# Altium schematic sheet 2. MCU & Peripherals.SchDoc: 2. Arduino Nano & ESP-WROOM-32
size A4; CompanyName: Keri Studio; DrawnBy: Ashis Talaviya; Organization: KERI STUDIO; Address1: ICG COMPOUND; Address2: NR. BHAVANI CIRCLE; Address3: A.K. ROAD; Address4: SURAT-395008; DocumentNumber: 2; Revision: 1.0; SheetNumber: 2; SheetTotal: 4
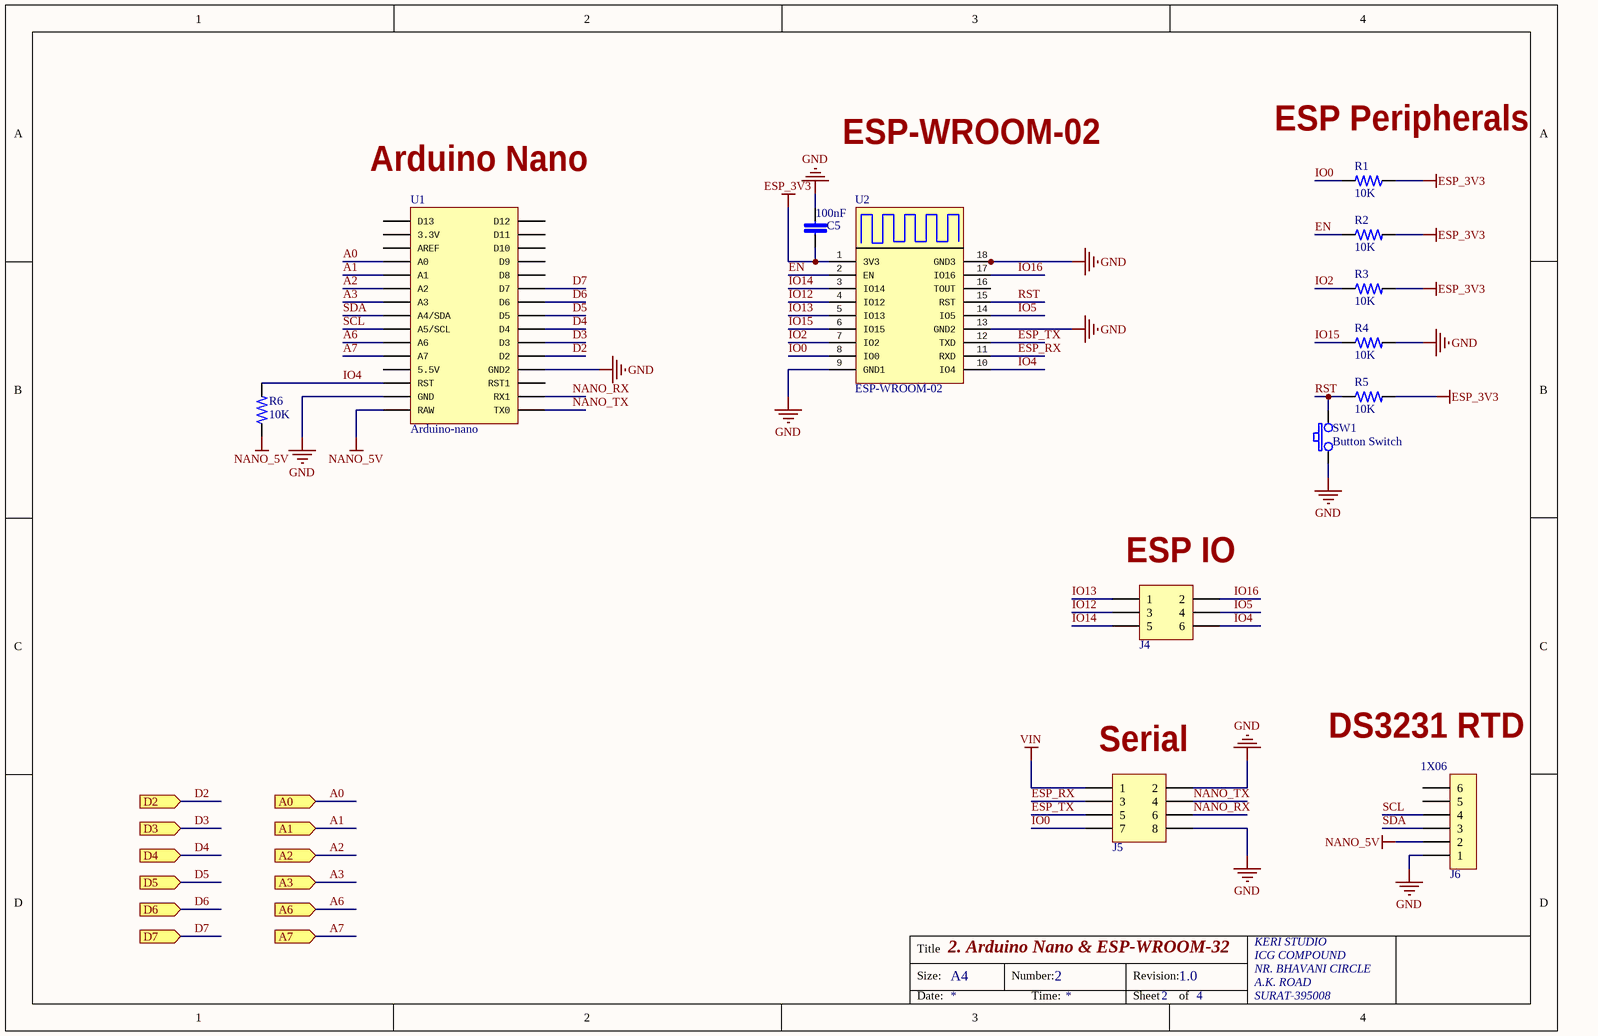
[diagram p0: 2. MCU & Peripherals.SchDoc]

## Parts
C5  100nF  [C0805]
J4  2X03  [Header_2.54mm_2X03]  (value not drawn)
J5  2X04  [Header_2.54mm_2X04]  (value not drawn)
J6  1X06  [Header_2.54mm_1X06]
R1  10K  [R0805]
R2  10K  [R0805]
R3  10K  [R0805]
R4  10K  [R0805]
R5  10K  [R0805]
R6  10K  [R0805]
SW1  Button Switch  [KSR231GLFS]
U1  Arduino-nano  [ARDUINO_NANO]
U2  ESP-WROOM-02  [ESP-WROOM-02]

## Ports
A0 (in), A1 (in), A2 (in), A3 (in), A6 (in), A7 (in), D2 (in), D3 (in), D4 (in), D5 (in), D6 (in), D7 (in)

## Nets
ESP_3V3: C5.2 R1.1 R2.2 R3.2 R5.2 U2.1(3V3)
GND: C5.1 J5.2 J5.8 J6.1 R4.2 SW1.1 U1.GND U1.GND1(GND2) U2.9(GND1) U2.13(GND2) U2.18(GND3) U2.19(GND0)
NANO_5V: J6.2 R6.1 U1.RAW
VIN: J5.1
A0: U1.A0 ; port A0
A1: U1.A1 ; port A1
A2: U1.A2 ; port A2
A3: U1.A3 ; port A3
A6: U1.A6 ; port A6
A7: U1.A7 ; port A7
D2: U1.D2 ; port D2
D3: U1.D3 ; port D3
D4: U1.D4 ; port D4
D5: U1.D5 ; port D5
D6: U1.D6 ; port D6
D7: U1.D7 ; port D7
EN: R2.1 U2.2(EN)
ESP_RX: J5.3 U2.11(RXD)
ESP_TX: J5.5 U2.12(TXD)
IO0: J5.7 R1.2 U2.8(IO0)
IO2: R3.1 U2.7(IO2)
IO4: J4.6 R6.2 U1.RST U2.10(IO4)
IO5: J4.4 U2.14(IO5)
IO12: J4.3 U2.4(IO12)
IO13: J4.1 U2.5(IO13)
IO14: J4.5 U2.3(IO14)
IO15: R4.1 U2.6(IO15)
IO16: J4.2 U2.17(IO16)
NANO_RX: J5.6 U1.RX1
NANO_TX: J5.4 U1.TX0
RST: R5.1 SW1.2 U2.15(RST)
SCL: J6.4 U1.A5(A5/SCL)
SDA: J6.3 U1.A4(A4/SDA)

Not connected (* = marked no-connect by the designer): J6 5 6; U1 3.3V 5V(5.5V) AREF D8 D9 D10 D11 D12 D13 RST1; U2 16(TOUT)

## Notes on the sheet
- (near U1) Arduino Nano
- ESP-WROOM-02
- (near R1) ESP Peripherals
- (near J4) ESP IO
- (near J5) Serial
- (near J6) DS3231 RTD
- Title
- Size:
- A4
- Number:
- Revision:
- Date:
- Time:
- Sheet
- of

## Library data of the parts
C5 = C_0805_0.1uF: Multilayer Ceramic Capacitors MLCC - SMD/SMT 0805 0.1uF 50volts X7R 20%; Manufacturer: Murata; Manufacturer Part Number: GCJ21BR71H104MA01L; Supplier 1: Mouser; Supplier Part Number 1: 81-GCJ21BR71H104MA1L; Stock 1: 0
J4 = Header_2.54mm_2X03: Headers & Wire Housings 03+03 DIL VERTICAL PIN HEADER TIN; Manufacturer: Harwin; Manufacturer Part Number: M20-9980346; Number of Contacts: 6; Contact Resistance: 25mR; Current Rating: 3A; Gender: Male; Insulation Resistance: 10GR; Connector Type: Male Pin; Pitch: 2.54mm; Row Spacing: 0.1inch; Supplier 1: Mouser; Stock 1: 8602; Pricing 1: 1=0.24, 10=0.229, 50=0.229, 100=0.159, 1000=0.11, 10000=0.089 (USD); Mount: Through Hole; Contact Plating: Nickel,Tin; Colour: Black; Contact Material: Bronze,Brass; Housing Colour: Black; Housing Material: Nylon; Min Operating Temperature: -40°C; Max Operating Temperature: 105°C; Number of Rows: 2; Termination: Solder; Package Quantity: 1000; Packaging: Bag; Max Current Rating: 3A; Number of Positions: 6; Orientation: Straight; Length: 7.62mm; Contact Mating Length: 0.24inch; Depth: 5.08mm; Radiation Hardening: No; REACH SVHC: No SVHC; ComponentLink1URL: https://datasheet.ciiva.com/11745/0900766b81034e61-11745752.pdf; ComponentLink1Description: https://datasheet.ciiva.com/11745/0900766b81034e61-11745752.pdf; ComponentLink2URL: https://datasheet.ciiva.com/26899/getdatasheetpartid-483857-26899433.pdf; ComponentLink2Description: https://datasheet.ciiva.com/26899/getdatasheetpartid-483857-26899433.pdf; ComponentLink3URL: https://datasheet.ciiva.com/8046/112195-8046906.pdf; ComponentLink3Description: https://datasheet.ciiva.com/8046/112195-8046906.pdf; Supplier Part Number 1: 855-M20-9980346
J5 = Header_2.54mm_2X04: Headers & Wire Housings 04+04 DIL VERTICAL PIN HEADER TIN; Manufacturer: Harwin; Manufacturer Part Number: M20-9980446; Number of Contacts: 8; Max Current Rating: 3A; Contact Resistance: 30mR; Gender: Male; Insulation Resistance: 10GR; Connector Type: Male Pin; Pitch: 2.54mm; Row Spacing: 0.1inch; Supplier 1: Mouser; Stock 1: 10983; Pricing 1: 1=0.3, 10=0.28, 50=0.28, 100=0.196, 1000=0.14, 10000=0.112 (USD); Mount: Through Hole; Contact Plating: Tin; Contact Material: Bronze,Brass; Colour: Black; Housing Colour: Black; Housing Material: Nylon; Min Operating Temperature: -40°C; Max Operating Temperature: 105°C; Number of Rows: 2; Termination: Solder; Current Rating: 3A; Package Quantity: 1000; Packaging: Bag; Number of Positions: 8; Orientation: Straight; Length: 10.16mm; Contact Mating Length: 0.24inch; Depth: 5.08mm; Radiation Hardening: No; REACH SVHC: No SVHC; ComponentLink1URL: https://datasheet.ciiva.com/11745/0900766b81034e61-11745748.pdf; ComponentLink1Description: https://datasheet.ciiva.com/11745/0900766b81034e61-11745748.pdf; ComponentLink2URL: https://datasheet.ciiva.com/6814/m20-998-6814757.pdf; ComponentLink2Description: https://datasheet.ciiva.com/6814/m20-998-6814757.pdf; ComponentLink3URL: https://datasheet.ciiva.com/9480/m20-998-9480200.pdf; ComponentLink3Description: https://datasheet.ciiva.com/9480/m20-998-9480200.pdf; ComponentLink4URL: https://datasheet.ciiva.com/26899/getdatasheetpartid-505183-26899434.pdf; ComponentLink4Description: https://datasheet.ciiva.com/26899/getdatasheetpartid-505183-26899434.pdf; ComponentLink5URL: https://datasheet.ciiva.com/8046/112195-8046909.pdf; ComponentLink5Description: https://datasheet.ciiva.com/8046/112195-8046909.pdf; Supplier Part Number 1: 855-M20-9980446
J6 = Header_2.54mm_1X06: CONNECTOR, 6WAY, VERTICAL, 2.54; Manufacturer: TE Connectivity; Manufacturer Part Number: 826646-6; Number of Contacts: 6; Connector Type: Plug,Pin,Header; PCB Mount Retention: Without; Board Standoff: No (Without); Keyed: No; Current Rating: 3A; Plating Thickness: 0.8um; Pitch: 2.54mm; Mating Post Length: 5.8mm; Supplier 1: Mouser; Stock 1: 1670; Pricing 1: 1=0.79, 10=0.693, 50=0.693, 100=0.598, 1000=0.435, 10000=0.354 (USD); Mount: Straddle Mount; Contact Plating: Tin,Gold; Contact Material: Bronze; Colour: Green; Housing Colour: Green; Housing Material: PBT; Contact Shape: Square; Min Operating Temperature: -65°C; Max Operating Temperature: 105°C; Number of Rows: 1; Termination: Through Hole; Packaging: Carton; Package Quantity: 1000; Number of Positions: 6; Orientation: Straight; PCB Mounting Orientation: Vertical; Contact Gender: Male; Contact Protection: No (Without); Gasket: No (Without); Mating Alignment: No (Without); Mating Connector Lock: No (Without); Selectively Loaded: No (Without); Stabilizers: No (Without); Strain Relief: No (Without); High Speed Serial Data Connector: No; High Temperature Housing: No; Length: 15.24mm; Termination Post Length: 0.1259inch; Contact Mating Length: 0.228inch; Row Spacing: 2.54mm; Depth: 2.5mm; Radiation Hardening: No; Flammability Rating: UL94 V-0; REACH SVHC: No SVHC; ComponentLink1URL: https://datasheet.ciiva.com/1448/47535-1448067.pdf; ComponentLink1Description: https://datasheet.ciiva.com/1448/47535-1448067.pdf; ComponentLink2URL: https://datasheet.ciiva.com/49517/abc918-49517591.pdf; ComponentLink2Description: https://datasheet.ciiva.com/49517/abc918-49517591.pdf; ComponentLink3URL: https://datasheet.ciiva.com/6816/eng-cd-826629-aa-basefilename-6816056.pdf; ComponentLink3Description: https://datasheet.ciiva.com/6816/eng-cd-826629-aa-basefilename-6816056.pdf; ComponentLink4URL: https://datasheet.ciiva.com/11754/0900766b80d7c469-11754285.pdf; ComponentLink4Description: https://datasheet.ciiva.com/11754/0900766b80d7c469-11754285.pdf; ComponentLink5URL: https://datasheet.ciiva.com/29369/001094744-da-01-en-stiftleiste-1-reihig-0-0826646-6-29369560.pdf; ComponentLink5Description: https://datasheet.ciiva.com/29369/001094744-da-01-en-stiftleiste-1-reihig-0-0826646-6-29369560.pdf; Supplier Part Number 1: 571-826646-6
R1-R6 = R_0805_10K: Thick Film Resistors - SMD 10K 0805 5%; Manufacturer: Bourns; Manufacturer Part Number: CR0805-JW-103ELF; Resistance: 10kR; Temperature Coefficient: 200ppm/°C; Power Rating: 125mW; Voltage Rating: 150V; Voltage Rating (DC): 100V; Supplier 1: Mouser; Supplier Part Number 1: 652-CR0805-JW-103ELF; Stock 1: 36802; Pricing 1: 1=0.1, 10=0.03, 50=0.03, 100=0.017, 1000=0.008, 10000=0.006 (USD); Mount: Surface Mount; Case/Package: 0805; Number of Pins: 2; Contact Plating: Tin; Case Code (Metric): 2012; Case Code (Imperial): 0805; Min Operating Temperature: -55°C; Max Operating Temperature: 155°C; Tolerance: 5%; Composition: Thick Film; Package Quantity: 1; Packaging: Tape and Reel; Number of Terminations: 2; Termination: SMD/SMT; Military Standard: Not; Max Power Dissipation: 125mW; Length: 2mm; Height: 0.5mm; Width: 1.25mm; Depth: 1.25mm; Thickness: 508um; Radiation Hardening: No; REACH SVHC: No SVHC; ComponentLink1URL: https://datasheet.ciiva.com/11821/0900766b80fcdb72-11821135.pdf; ComponentLink1Description: https://datasheet.ciiva.com/11821/0900766b80fcdb72-11821135.pdf; ComponentLink2URL: https://datasheet.ciiva.com/9122/chpreztr-9122374.pdf; ComponentLink2Description: https://datasheet.ciiva.com/9122/chpreztr-9122374.pdf; ComponentLink3URL: https://datasheet.ciiva.com/22693/1902866-22693254.pdf; ComponentLink3Description: https://datasheet.ciiva.com/22693/1902866-22693254.pdf; ComponentLink4URL: https://datasheet.ciiva.com/30065/159chpreztr-30065976.pdf; ComponentLink4Description: https://datasheet.ciiva.com/30065/159chpreztr-30065976.pdf; ComponentLink5URL: https://datasheet.ciiva.com/16783/70154685-16783482.pdf; ComponentLink5Description: https://datasheet.ciiva.com/16783/70154685-16783482.pdf; ComponentLink6URL: https://datasheet.ciiva.com/5548/chpreztr-5548491.pdf; ComponentLink6Description: https://datasheet.ciiva.com/5548/chpreztr-5548491.pdf; ComponentLink7URL: https://datasheet.ciiva.com/7986/691949-7986187.pdf; ComponentLink7Description: https://datasheet.ciiva.com/7986/691949-7986187.pdf; ComponentLink8URL: https://datasheet.ciiva.com/6559/chpreztr-6559900.pdf; ComponentLink8Description: https://datasheet.ciiva.com/6559/chpreztr-6559900.pdf; ComponentLink9URL: https://datasheet.ciiva.com/6559/chpreztr-6559901.pdf; ComponentLink9Description: https://datasheet.ciiva.com/6559/chpreztr-6559901.pdf; ComponentLink10URL: https://datasheet.ciiva.com/7985/1856384-7985869.pdf; ComponentLink10Description: https://datasheet.ciiva.com/7985/1856384-7985869.pdf; ComponentLink11URL: https://datasheet.ciiva.com/48692/001055517-da-01-en-smd-wid-cr0805-jw-103elf-10k-ohm-1-8w-48692118.pdf; ComponentLink11Description: https://datasheet.ciiva.com/48692/001055517-da-01-en-smd-wid-cr0805-jw-103elf-10k-ohm-1-8w-48692118.pdf
SW1 = Button_Switch: SWITCH TACTILE SPST-NO 0.05A 32V; Manufacturer: ITT C&K; Mechanical Life: 100000Cycles; Actuator Material: Rubber; Throw Configuration: SPST; Operating Force: 3N; Max Current Rating: 50mA; Contact Resistance: 100mR; Power Rating: 1W; Illumination Type: Non-Illuminated,Illuminated; Insulation Resistance: 1GR; Switch Travel: 0.35mm; Switch Function: Off-Mom; Actuator Length: 0.75mm; IP Rating: IP50; Supplier 1: Digi-Key; Supplier Part Number 1: 401-1706-6-ND; Stock 1: 11668; Pricing 1: 1=0.61, 10=0.585, 25=0.574, 50=0.5522, 100=0.4764, 250=0.43312, 500=0.41148, 1000=0.32485 (USD); Mount: Surface Mount; Contact Material: Silver; Contact Plating: Silver; Min Operating Temperature: -40°C; Max Operating Temperature: 85°C; Max Voltage Rating (DC): 32V; Termination: Gull Wing; Voltage Rating (DC): 32V; Packaging: Tape and Reel; Package Quantity: 1; Contact Current Rating: 50mA; Current Rating: 50mA; Orientation: Straight; Length: 7.3mm; Depth: 3.8mm; Width: 6mm; Radiation Hardening: No; REACH SVHC: No SVHC; Lead Free: Lead Free; ComponentLink1URL: https://datasheet.ciiva.com/7986/1728697-7986994.pdf; ComponentLink1Description: https://datasheet.ciiva.com/7986/1728697-7986994.pdf; ComponentLink2URL: https://datasheet.ciiva.com/30466/0900766b8129cd35-30466700.pdf; ComponentLink2Description: https://datasheet.ciiva.com/30466/0900766b8129cd35-30466700.pdf; ComponentLink3URL: https://datasheet.ciiva.com/2900/ksr-2900293.pdf; ComponentLink3Description: https://datasheet.ciiva.com/2900/ksr-2900293.pdf; ComponentLink4URL: https://datasheet.ciiva.com/2900/ksr-2900294.pdf; ComponentLink4Description: https://datasheet.ciiva.com/2900/ksr-2900294.pdf; ComponentLink5URL: https://datasheet.ciiva.com/2900/ksr-2900295.pdf; ComponentLink5Description: https://datasheet.ciiva.com/2900/ksr-2900295.pdf; ComponentLink6URL: https://datasheet.ciiva.com/46387/1780692-46387193.pdf; ComponentLink6Description: https://datasheet.ciiva.com/46387/1780692-46387193.pdf; ComponentLink7URL: https://datasheet.ciiva.com/5684/1728697-5684458.pdf; ComponentLink7Description: https://datasheet.ciiva.com/5684/1728697-5684458.pdf; ComponentLink8URL: https://datasheet.ciiva.com/16396/ksr231glfs-16396266.pdf; ComponentLink8Description: https://datasheet.ciiva.com/16396/ksr231glfs-16396266.pdf; ComponentLink9URL: https://datasheet.ciiva.com/22712/1728697-22712106.pdf; ComponentLink9Description: https://datasheet.ciiva.com/22712/1728697-22712106.pdf; ComponentLink10URL: https://datasheet.ciiva.com/8167/ksr-8167660.pdf; ComponentLink10Description: https://datasheet.ciiva.com/8167/ksr-8167660.pdf; ComponentLink11URL: https://datasheet.ciiva.com/5283/ksr-5283645.pdf; ComponentLink11Description: https://datasheet.ciiva.com/5283/ksr-5283645.pdf; Manufacturer Part Number: KSR231GLFS
U1 = Arduino-nano: ARDUINO   A000005   ATMEGA328, ARDUINO NANO, EVAL BOARD; Evaluation Kit: Yes; Interface: I2C,SPI,USB; Data Bus Width: 8b; Number of Bits: 8; Core Architecture: AVR; Operating Supply Voltage: 20V; Supplier 1: Mouser; Manufacturer: Arduino; Manufacturer Part Number: A000005; Stock 1: 0; Weight: 0.02lb; Package Quantity: 1; Packaging: Bulk; Length: 7inch; Height: 0.25inch; Width: 5inch; REACH SVHC: No SVHC; ComponentLink1URL: https://datasheet.ciiva.com/19455/2121148-19455443.pdf; ComponentLink1Description: https://datasheet.ciiva.com/19455/2121148-19455443.pdf; ComponentLink2URL: https://datasheet.ciiva.com/1336/1682238-1336473.pdf; ComponentLink2Description: https://datasheet.ciiva.com/1336/1682238-1336473.pdf; ComponentLink3URL: https://datasheet.ciiva.com/1414/810078-1414124.pdf; ComponentLink3Description: https://datasheet.ciiva.com/1414/810078-1414124.pdf; ComponentLink4URL: https://datasheet.ciiva.com/2398/arduinonanomanual23-2398236.pdf; ComponentLink4Description: https://datasheet.ciiva.com/2398/arduinonanomanual23-2398236.pdf; ComponentLink5URL: https://datasheet.ciiva.com/4926/arduino-arduinoboardnano-188748-4926316.pdf; ComponentLink5Description: https://datasheet.ciiva.com/4926/arduino-arduinoboardnano-188748-4926316.pdf; ComponentLink6URL: https://datasheet.ciiva.com/20168/73-4448-20168542.pdf; ComponentLink6Description: https://datasheet.ciiva.com/20168/73-4448-20168542.pdf; ComponentLink7URL: https://datasheet.ciiva.com/12069/arduino-arduinoboardnano-12069727.pdf; ComponentLink7Description: https://datasheet.ciiva.com/12069/arduino-arduinoboardnano-12069727.pdf; Supplier Part Number 1: 992-ARD-NANO30
U2 = ESP-WROOM-02: WiFi Modules (802.11) SMD Module, ESP8266EX, 16Mbits SPI flash, UART Mode; Manufacturer: Espressif Systems; Supplier 1: Mouser; Manufacturer Part Number: ESP-WROOM-02; Stock 1: 4063; Pricing 1: 1=2.7, 10=2.7, 50=2.7, 100=2.7, 1000=2.7, 10000=2.7 (USD); Supplier Part Number 1: 356-ESP-WROOM-02; ComponentLink1Description: Datasheet; ComponentLink1URL: https://espressif.com/sites/default/files/documentation/0c-esp-wroom-02_datasheet_en.pdf